# Altium schematic sheet 室内空气监测MSP430.SchDoc
size A3
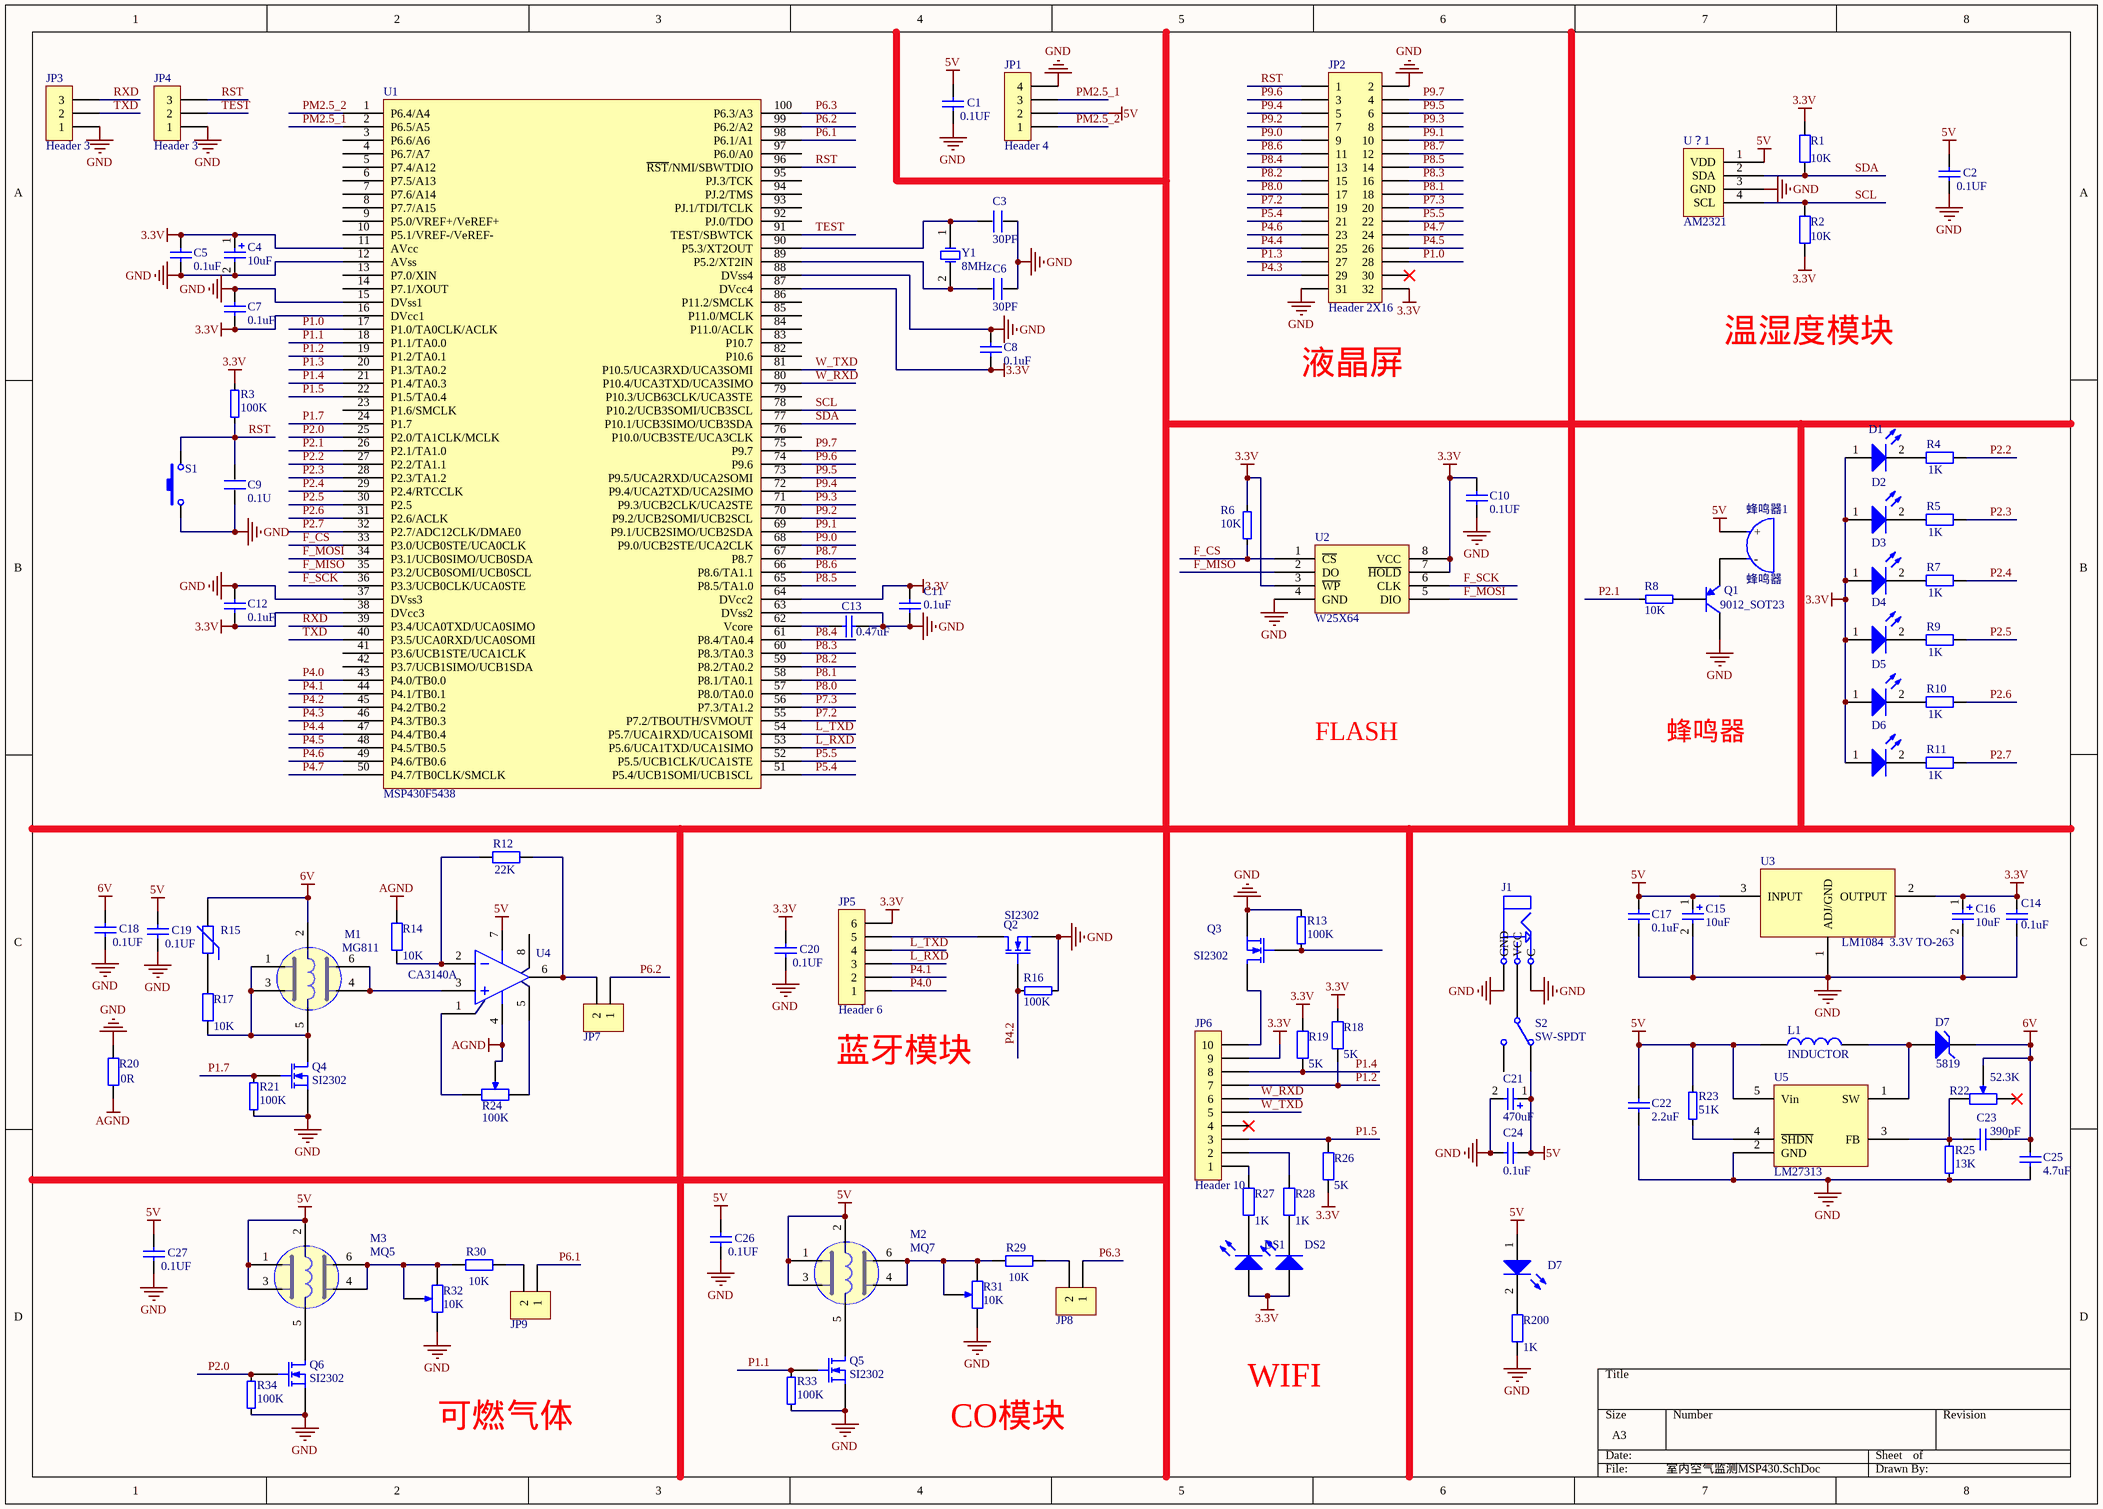
[diagram p0: 室内空气监测MSP430.SchDoc]

## Parts
(Parts that share a designator on the sheet are numbered #1, #2 ... from top to bottom, then left to right.)
C1  0.1UF  [0603C]
C2  0.1UF  [0603C]
C3  30PF  [0603P]
C4  value 10uF  [0805C 10uf]  (hidden comment: Cap Pol2)
C5  0.1uF  [0603C]
C6  30PF  [0603P]
C7  0.1uF  [0603C]
C8  0.1uF  [0603C]
C9  0.1U  [0603P]
C10  0.1UF  [0603C]
C11  0.1uF  [0603C]
C12  0.1uF  [0603C]
C13  0.47uF  [0603C]
C14  0.1uF  [0603C]
C15  value 10uF  [0805C 10uf]  (hidden comment: Cap Pol2)
C16  value 10uF  [0805C 10uf]  (hidden comment: Cap Pol2)
C17  0.1uF  [0603C]
C18  0.1UF  [0603C]
C19  0.1UF  [0603C]
C20  0.1UF  [0603C]
C21  value 470uF  [7343 E型]  (hidden comment: Cap Pol2)
C22  2.2uF  [0603C]
C23  390pF  [0603C]
C24  0.1uF  [0603C]
C25  4.7uF  [0603C]
C26  0.1UF  [0603C]
C27  0.1UF  [0603C]
D1  (no value)  [LED0.1-0.15]
D2  (no value)  [LED0.1-0.15]
D3  (no value)  [LED0.1-0.15]
D4  (no value)  [LED0.1-0.15]
D5  (no value)  [LED0.1-0.15]
D6  (no value)  [LED0.1-0.15]
D7#1  5819  [Diode-5819]
D7#2  (no value)  [LED0.1-0.15]
DS1  (no value)  [SMDLED]
DS2  (no value)  [SMDLED]
J1  (no value)  [PWJ-2/3]
JP1  Header 4  [HDR1-4]
JP2  Header 2X16  [HDR2-16]
JP3  Header 3  [HDR1-3]
JP4  Header 3  [HDR1-3]
JP5  Header 6  [HDR1-6]
JP6  Header 10  [header 10 2.0]
JP7  (no value)  [HDR1-2]
JP8  (no value)  [HDR1-2]
JP9  (no value)  [HDR1-2]
L1  INDUCTOR  [0640 贴片电感]
M1  MG811  [MG811]
M2  MQ7  [MG811]
M3  MQ5  [MG811]
Q1  9012_SOT23  [SOT-23-3L]
Q2  SI2302  [SOT23]
Q3  SI2302  [SOT23]
Q4  SI2302  [SOT23]
Q5  SI2302  [SOT23]
Q6  SI2302  [SOT23]
R1  value 10K  [0603R]
R2  value 10K  [0603R]
R3  100K  [0603R]
R4  value 1K  [0603R]
R5  value 1K  [0603R]
R6  10K  [0603R]
R7  value 1K  [0603R]
R8  10K  [0603R]
R9  value 1K  [0603R]
R10  value 1K  [0603R]
R11  value 1K  [0603R]
R12  value 22K  [0603R]
R13  100K  [0603R]
R14  value 10K  [0603R]
R15  (no value)  [0603R]
R16  100K  [0603R]
R17  value 10K  [0603R]
R18  value 5K  [0603R]
R19  value 5K  [0603R]
R20  value 0R  [0603R]
R21  100K  [0603R]
R22  value 52.3K  [电位器 贴片]  (hidden comment: RES-Pot2)
R23  51K  [0603R]
R24  value 100K  [电位器 贴片]  (hidden comment: RES-Pot2)
R25  13K  [0603R]
R26  value 5K  [0603R]
R27  value 1K  [0603R]
R28  value 1K  [0603R]
R29  value 10K  [0603R]
R30  value 10K  [0603R]
R31  value 10K  [电位器 贴片]  (hidden comment: RES-Pot2)
R32  value 10K  [电位器 贴片]  (hidden comment: RES-Pot2)
R33  100K  [0603R]
R34  100K  [0603R]
R200  value 1K  [0603R]
S1  (no value)  [两脚贴片按键]
S2  SW-SPDT  [大电流拨动开关 两档三脚]
U1  MSP430F5438  [PQFPG100]
U2  W25X64  [W25X64]
U3  LM1084  3.3V TO-263  [LM1084 TO-263]
U4  CA3140A  [SOP8]
U5  LM27313  [LM27313]
U？1  AM2321  [AM2321]
Y1  8MHz  [XTAL_US]
蜂鸣器1  蜂鸣器  [BELL0.3-0.46]

## Nets
3.3V: C4.1 C5.2 C7.1 C8.1 C10.2 C11.2 C12.1 C14.2 C16.1 C20.1 D1.1(A) D2.1(A) D3.1(A) D4.1(A) D5.1(A) D6.1(A) DS1.1(A) DS2.1(A) JP2.32 JP5.6 JP6.9 R1.1 R2.2 R3.2 R6.1 R18.1 R19.1 R26.2 U1.11(AVcc) U1.16(DVcc1) U1.38(DVcc3) U1.64(DVcc2) U1.87(DVcc4) U2.3(~{WP}) U2.7(~{HOLD}) U2.8(VCC) U3.2(OUTPUT)
5V: C1.1 C2.1 C15.1 C17.2 C19.1 C21.1 C22.2 C24.1 C26.1 C27.1 D7#2.1(A) JP1.2 L1.1 M2.1 M2.2 M2.3 M3.1 M3.2 M3.3 R23.1 S2.1(NC) U3.3(INPUT) U4.7 U5.5(Vin) U？1.1(VDD) 蜂鸣器1.1(+)
6V: C18.1 C23.2 C25.2 D7#1.2(K) M1.2 R15.2 R22.2(TAP)
AGND: R14.2 R20.1 R24.2(TAP) U4.4
GND: C1.2 C2.2 C3.2 C4.2 C5.1 C6.2 C7.2 C8.2 C9.1 C10.1 C11.1 C12.2 C13.1 C14.1 C15.2 C16.2 C17.1 C18.2 C19.2 C20.2 C21.2 C22.1 C24.2 C25.1 C26.2 C27.2 J1.2(GND) J1.3(C) JP1.4 JP2.2 JP2.31 JP3.1 JP4.1 Q1.3(C) Q2.2(S) Q3.2(S) Q4.2(S) Q5.2(S) Q6.2(S) R13.2 R16.2 R20.2 R21.2 R25.2 R31.1(BOT) R32.1(BOT) R33.2 R34.2 R200.1 S1.1 U1.12(AVss) U1.15(DVss1) U1.37(DVss3) U1.63(DVss2) U1.88(DVss4) U2.4(GND) U3.1(ADJ/GND) U5.2(GND) U？1.3(GND)
F_CS: R6.2 U1.33(P3.0/UCB0STE/UCA0CLK) U2.1(~{CS})
F_MISO: U1.35(P3.2/UCB0SOMI/UCB0SCL) U2.2(DO)
F_MOSI: U1.34(P3.1/UCB0SIMO/UCB0SDA) U2.5(DIO)
F_SCK: U1.36(P3.3/UCB0CLK/UCA0STE) U2.6(CLK)
L_RXD: JP5.3 U1.53(P5.6/UCA1TXD/UCA1SIMO)
L_TXD: JP5.4 U1.54(P5.7/UCA1RXD/UCA1SOMI)
P1.0: JP2.28 U1.17(P1.0/TA0CLK/ACLK)
P1.1: Q5.1(G) R33.1 U1.18(P1.1/TA0.0)
P1.2: JP6.7 R18.2 U1.19(P1.2/TA0.1)
P1.3: JP2.27 U1.20(P1.3/TA0.2)
P1.4: JP6.8 R19.2 U1.21(P1.4/TA0.3)
P1.5: JP6.3 R26.1 U1.22(P1.5/TA0.4)
P1.7: Q4.1(G) R21.1 U1.24(P1.7)
P2.0: Q6.1(G) R34.1 U1.25(P2.0/TA1CLK/MCLK)
P2.1: R8.2 U1.26(P2.1/TA1.0)
P2.2: R4.2 U1.27(P2.2/TA1.1)
P2.3: R5.2 U1.28(P2.3/TA1.2)
P2.4: R7.2 U1.29(P2.4/RTCCLK)
P2.5: R9.2 U1.30(P2.5)
P2.6: R10.2 U1.31(P2.6/ACLK)
P2.7: R11.2 U1.32(P2.7/ADC12CLK/DMAE0)
P4.0: JP5.1 U1.43(P4.0/TB0.0)
P4.1: JP5.2 U1.44(P4.1/TB0.1)
P4.2: Q2.1(G) R16.1 U1.45(P4.2/TB0.2)
P4.3: JP2.29 U1.46(P4.3/TB0.3)
P4.4: JP2.25 U1.47(P4.4/TB0.4)
P4.5: JP2.26 U1.48(P4.5/TB0.5)
P4.6: JP2.23 U1.49(P4.6/TB0.6)
P4.7: JP2.24 U1.50(P4.7/TB0CLK/SMCLK)
P5.4: JP2.21 U1.51(P5.4/UCB1SOMI/UCB1SCL)
P5.5: JP2.22 U1.52(P5.5/UCB1CLK/UCA1STE)
P6.1: JP9.1 U1.98(P6.1/A1)
P6.2: JP7.1 U1.99(P6.2/A2)
P6.3: JP8.1 U1.100(P6.3/A3)
P7.2: JP2.19 U1.55(P7.2/TBOUTH/SVMOUT)
P7.3: JP2.20 U1.56(P7.3/TA1.2)
P8.0: JP2.17 U1.57(P8.0/TA0.0)
P8.1: JP2.18 U1.58(P8.1/TA0.1)
P8.2: JP2.15 U1.59(P8.2/TA0.2)
P8.3: JP2.16 U1.60(P8.3/TA0.3)
P8.4: JP2.13 U1.61(P8.4/TA0.4)
P8.5: JP2.14 U1.65(P8.5/TA1.0)
P8.6: JP2.11 U1.66(P8.6/TA1.1)
P8.7: JP2.12 U1.67(P8.7)
P9.0: JP2.9 U1.68(P9.0/UCB2STE/UCA2CLK)
P9.1: JP2.10 U1.69(P9.1/UCB2SIMO/UCB2SDA)
P9.2: JP2.7 U1.70(P9.2/UCB2SOMI/UCB2SCL)
P9.3: JP2.8 U1.71(P9.3/UCB2CLK/UCA2STE)
P9.4: JP2.5 U1.72(P9.4/UCA2TXD/UCA2SIMO)
P9.5: JP2.6 U1.73(P9.5/UCA2RXD/UCA2SOMI)
P9.6: JP2.3 U1.74(P9.6)
P9.7: JP2.4 U1.75(P9.7)
PM2.5_1: JP1.3 U1.2(P6.5/A5)
PM2.5_2: JP1.1 U1.1(P6.4/A4)
RST: C9.2 JP2.1 JP4.3 R3.1 S1.2 U1.96(~{RST}/NMI/SBWTDIO)
RXD: JP3.3 U1.39(P3.4/UCA0TXD/UCA0SIMO)
SCL: R2.1 U1.78(P10.2/UCB3SOMI/UCB3SCL) U？1.4(SCL)
SDA: R1.2 U1.77(P10.1/UCB3SIMO/UCB3SDA) U？1.2(SDA)
TEST: JP4.2 U1.91(TEST/SBWTCK)
TXD: JP3.2 U1.40(P3.5/UCA0RXD/UCA0SOMI)
W_RXD: JP6.6 U1.80(P10.4/UCA3TXD/UCA3SIMO)
W_TXD: JP6.5 U1.81(P10.5/UCA3RXD/UCA3SOMI)
NetC3_1: C3.1 U1.90(P5.3/XT2OUT) Y1.1(OSC1)
NetC6_1: C6.1 U1.89(P5.2/XT2IN) Y1.2(OSC2)
NetC13_2: C13.2 U1.62(Vcore)
NetC23_1: C23.1 R22.1(BOT) R25.1 U5.3(FB)
NetD1_2: D1.2(K) R4.1
NetD2_2: D2.2(K) R5.1
NetD3_2: D3.2(K) R7.1
NetD4_2: D4.2(K) R9.1
NetD5_2: D5.2(K) R10.1
NetD6_2: D6.2(K) R11.1
NetD7#1_1: D7#1.1(A) L1.2 U5.1(SW)
NetD7#2_2: D7#2.2(K) R200.2
NetDS1_2: DS1.2(K) R27.2
NetDS2_2: DS2.2(K) R28.2
NetJ1_1: J1.1(VCC) S2.2(COMMON)
NetJP5_5: JP5.5 Q2.3(D)
NetJP6_1: JP6.1 R27.1
NetJP6_2: JP6.2 R28.1
NetJP6_10: JP6.10 Q3.3(D)
NetJP7_2: JP7.2 R12.1 U4.6
NetJP8_2: JP8.2 R29.2
NetJP9_2: JP9.2 R30.2
NetM1_1: M1.1 M1.3 M1.5 Q4.3(D) R17.1
NetM1_4: M1.4 M1.6 U4.3
NetM2_4: M2.4 M2.6 R29.1 R31.2(TAP) R31.3(TOP)
NetM2_5: M2.5 Q5.3(D)
NetM3_4: M3.4 M3.6 R30.1 R32.2(TAP) R32.3(TOP)
NetM3_5: M3.5 Q6.3(D)
NetQ1_1: Q1.1(B) R8.1
NetQ1_2: Q1.2(E) 蜂鸣器1.2(-)
NetQ3_1: Q3.1(G) R13.1
NetR12_2: R12.2 R14.1 U4.2
NetR15_1: R15.1 R17.2
NetR23_2: R23.2 U5.4(~{SHDN})
NetR24_1: R24.1(BOT) U4.1
NetR24_3: R24.3(TOP) U4.5

Not connected (* = marked no-connect by the designer): JP2 30*; JP6 4*; R22 3(TOP)*; S2 3(NO); U1 3(P6.6/A6) 4(P6.7/A7) 5(P7.4/A12) 6(P7.5/A13) 7(P7.6/A14) 8(P7.7/A15) 9(P5.0/VREF+/VeREF+) 10(P5.1/VREF-/VeREF-) 13(P7.0/XIN) 14(P7.1/XOUT) 23(P1.6/SMCLK) 41(P3.6/UCB1STE/UCA1CLK) 42(P3.7/UCB1SIMO/UCB1SDA) 76(P10.0/UCB3STE/UCA3CLK) 79(P10.3/UCB63CLK/UCA3STE) 82(P10.6) 83(P10.7) 84(P11.0/ACLK) 85(P11.0/MCLK) 86(P11.2/SMCLK) 92(PJ.0/TDO) 93(PJ.1/TDI/TCLK) 94(PJ.2/TMS) 95(PJ.3/TCK) 97(P6.0/A0); U4 8

## Notes on the sheet
- 液晶屏
- 温湿度模块
- FLASH
- 蜂鸣器
- (near JP5) 蓝牙模块
- WIFI
- 可燃气体
- CO模块

## Library data of the parts
C1 C2 C5 C7 C8 C10-C14 C17-C20 C22-C27 = Cap: Capacitor; Manufacturer: Generic Components; Class: Passive; Published: 08/06/2000; Publisher: Altium Hobart Technology Centre; SubClass: Capacitor
C3 C6 C9 = C
C4 C15 C16 C21 = Cap Pol2: Polarized Capacitor (Axial); Manufacturer: Generic Components; Class: Passive; Published: 08/06/2000; Publisher: Altium Hobart Technology Centre; SubClass: Capacitor
D1-D6 D7#2 = LED: Typical RED, GREEN, YELLOW, AMBER GaAs LED; Manufacturer: Generic Components; Class: Optoelectronic; Published: 08/06/2000; Publisher: Altium Hobart Technology Centre; SubClass: LED
D7#1 = Diode -Zener: Zener Diode; Manufacturer: Generic Components; Class: Discrete; Value: 5V; Published: 08/06/2000; Publisher: Altium Hobart Technology Centre; SubClass: Diode - Zener
DS1 DS2 = LED2: Typical RED, GREEN, YELLOW, AMBER GaAs LED; Published: 8-Jun-2000; LatestRevisionDate: 17-Jul-2002; LatestRevisionNote: Re-released for DXP Platform.; PackageDocument: Feb-2002; PackageReference: 3.2X1.6X1.1; Publisher: Altium Limited
J1 = Powerjack_F: 2-Conductor Jack with 1 break contact; Manufacturer: Generic Components; Class: Connector
JP1 = Header 4: Header, 4-Pin; Manufacturer: Generic Components; Class: Connector
JP2 = Header 2X16: Header, 16Pin, Dual row; Manufacturer: Generic Components; Class: Connector
JP3 JP4 = Header 3: Header, 3-Pin; Manufacturer: Generic Components; Class: Connector
JP5 = Header 6: Header, 6-Pin; Manufacturer: Generic Components; Class: Connector
JP6 = Header 10: Header, 10-Pin; Manufacturer: Generic Components; Class: Connector
JP7-JP9 = Header 2: Header, 2-Pin; Manufacturer: Generic Components; Class: Connector
M2 M3 = MG811
Q2-Q6 = SI2302 A2SHB: N-Channel MOSFET; Manufacturer: Generic Components; Class: Discrete; SubClass: MOSFET - Low Power; Published: 08/06/2000; Publisher: Altium Hobart Technology Centre
R1 R2 R4 R5 R7 R9-R12 R14 R17-R20 R26-R30 R200 = Res: Resistor; Manufacturer: Generic Components; Class: Passive; Published: 08/06/2000; Publisher: Altium Hobart Technology Centre; SubClass: Resistor
R3 R6 R8 R13 R16 R21 R23 R25 R33 R34 = R-10K: resistor
R15 = Res Varistor: Published: 24-Mar-1999; LatestRevisionDate: 4-Mar-2005; LatestRevisionNote: PCB Footprint replaced.; Publisher: Altium Limited
R22 R24 R31 R32 = RES-Pot2: Potentiometer; Class: Passive; SubClass: Potentiometer
S1 = SW-PB_1: Switch; Manufacturer: Generic Components; Published: 1999
S2 = SW-SPDT: Single-Pole, Double-Throw Switch; Manufacturer: Generic Components; Published: 1999
U3 = LM1084 TO-263
Y1 = XTAL: Crystal Oscillator; Published: 8-Jun-2000; LatestRevisionDate: 17-Jul-2002; LatestRevisionNote: Re-released for DXP Platform.; Publisher: Altium Limited
蜂鸣器1 = Buzzer: Manufacturer: Generic Components; Published: 1999